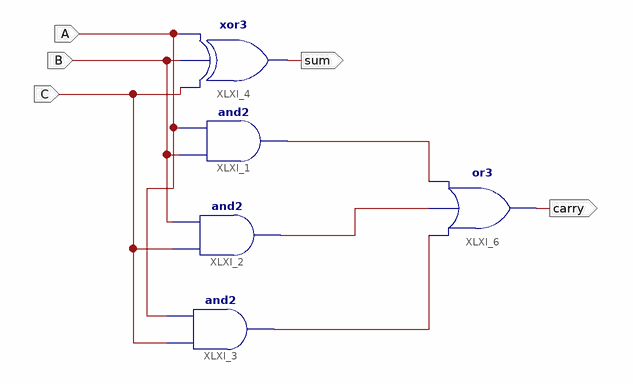
[diagram p0: schematic sheet 1]
// Xilinx ISE schematic adderSub.sch (artix7) as structural Verilog: 5 symbols, 5 ports
module adderSub (
  input  A,
  input  B,
  input  C,
  output sum,
  output carry
);

  wire XLXN_1, XLXN_2, XLXN_3;

  and XLXI_1 (XLXN_1, B, A);
  and XLXI_2 (XLXN_2, C, B);
  and XLXI_3 (XLXN_3, C, A);
  xor XLXI_4 (sum, C, B, A);
  or XLXI_6 (carry, XLXN_3, XLXN_2, XLXN_1);
endmodule
